# EAGLE schematic xbee-smd-breakout-1 (EAGLE 7.4.0)
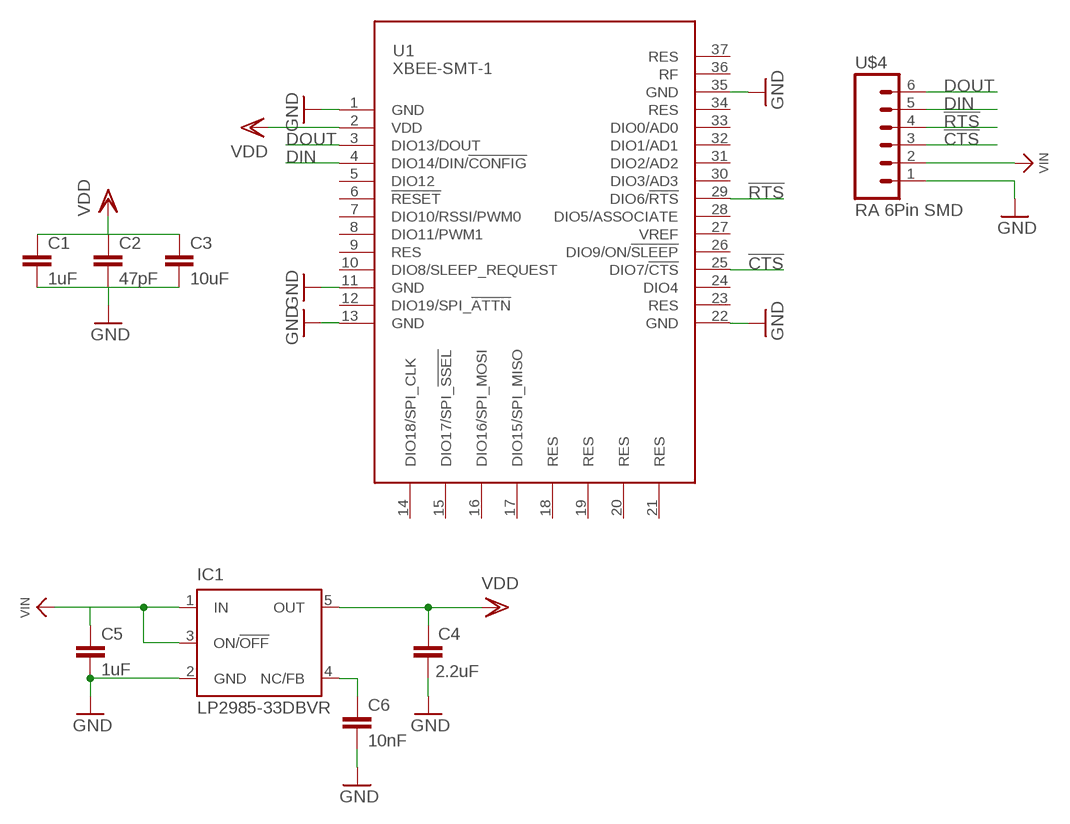
[diagram p0: schematic, sheet 1]

## Parts
C1  1uF  C  [C0805]
C2  47pF  C  [C0805]
C3  10uF  C  [C0805]
C4  2.2uF  C-EUC0805  [C0805]
C5  1uF  C  [C0805]
C6  10nF  C  [C0805]
IC1  LP2985-33DBVR  LP2985-XXDBVR33  [SOT23-DBV]
U1  XBEE-SMT-1  [XBEE-SMT]
U$4  RA 6Pin SMD  M06SMD  [1X06-SMD]

## Nets
!CTS: U1.25(DIO7/!CTS) U$4.3
!RTS: U1.29(DIO6/!RTS) U$4.4
DIN: U1.4(DIO14/DIN/!CONFIG) U$4.5
DOUT: U1.3(DIO13/DOUT) U$4.6
GND: C1.2 C2.2 C3.2 C4.1 C5.2 C6.2 IC1.2(GND) U1.1(GND) U1.11(GND) U1.13(GND) U1.22(GND) U1.35(GND) U$4.1
N$1: C6.1 IC1.4(NC/FB)
VDD: C1.1 C2.1 C3.1 C4.2 IC1.5(OUT) U1.2(VDD)
VIN: C5.1 IC1.1(IN) IC1.3(ON/!OFF) U$4.2
Unconnected: U1.5(DIO12) U1.6(!RESET) U1.7(DIO10/RSSI/PWM0) U1.8(DIO11/PWM1) U1.9(RES) U1.10(DIO8/SLEEP_REQUEST) U1.12(DIO19/SPI_!ATTN) U1.14(DIO18/SPI_CLK) U1.15(DIO17/SPI_!SSEL) U1.16(DIO16/SPI_MOSI) U1.17(DIO15/SPI_MISO) U1.18(RES) U1.19(RES) U1.20(RES) U1.21(RES) U1.23(RES) U1.24(DIO4) U1.26(DIO9/ON/!SLEEP) U1.27(VREF) U1.28(DIO5/ASSOCIATE) U1.30(DIO3/AD3) U1.31(DIO2/AD2) U1.32(DIO1/AD1) U1.33(DIO0/AD0) U1.34(RES) U1.36(RF) U1.37(RES)

## Library data of the parts
C1-C3 C5 C6 = eagle-ltspice:C: CAPACITOR, European symbol; SPICEMODEL: NONE; SPICEPREFIX: C
C4 = rcl:C-EU: CAPACITOR, European symbol; MF: MULTICOMP; MPN: MC0805B104K500CT; OC_FARNELL: 1759265
IC1 = SmartPrj:LP2985-XXDBVR: ULTRALOW-POWER 50-mA LOW-DROPOUT LINEAR REGULATORS 50-mA Low-Dropout Regulator Source: http://focus.ti.com/lit/ds/symlink/tps77001.pdf; MF: ANALOG DEVICES; MPN: ADP3309ARTZ-3.3-R7; OC_FARNELL: 2376922
U1 = rlc:XBEE-SMT-1
U$4 = SparkFun-Connectors:M06: Header 6 Standard 6-pin 0.1" header. Use with straight break away headers (SKU : PRT-00116), right angle break away headers (PRT-00553), swiss pins (PRT-00743), machine pins (PRT-00117), and female headers (PRT-00115). Molex polarized connector foot print use with SKU : PRT-08094 with associated crimp pins and housings. NOTES ON THE VARIANTS LOCK and LOCK_LONGPADS... This footprint was designed to help hold the alignment of a through-hole component (i.e. 6-pin header) while soldering it into place. You may notice that each hole has been shifted either up or down by 0.005 of an inch from it's more standard position (which is a perfectly straight line). This slight alteration caused the pins (the squares in the middle) to touch the edges of the holes. Because they are alternating, it causes a "brace" to hold the component in place. 0.005 has proven to be the perfect amount of "off-center" position when using our standard breakaway headers. Although looks a little odd when you look at the bare footprint, once you have a header in there, the alteration is very hard to notice. Also,if you push a header all the way into place, it is covered up entirely on the bottom side. This idea of altering the position of holes to aid alignment will be further integrated into the Sparkfun Library for other footprints. It can help hold any component with 3 or more connection pins.; PROD_ID: CONN-08971